# Altium schematic sheet SSSTempLib.SchDoc
size A4
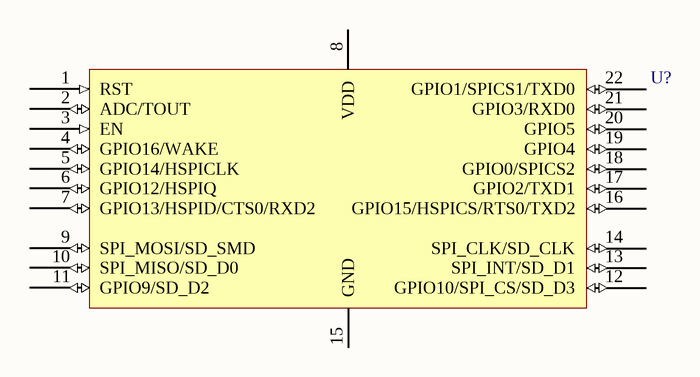
[diagram p0: SSSTempLib.SchDoc]

## Parts
U?  ESP-12E  [317060015]  (value not drawn)

## Nets

Not connected (* = marked no-connect by the designer): U? 1(RST) 2(ADC/TOUT) 3(EN) 4(GPIO16/WAKE) 5(GPIO14/HSPICLK) 6(GPIO12/HSPIQ) 7(GPIO13/HSPID/CTS0/RXD2) 8(VDD) 9(SPI_MOSI/SD_SMD) 10(SPI_MISO/SD_D0) 11(GPIO9/SD_D2) 12(GPIO10/SPI_CS/SD_D3) 13(SPI_INT/SD_D1) 14(SPI_CLK/SD_CLK) 15(GND) 16(GPIO15/HSPICS/RTS0/TXD2) 17(GPIO2/TXD1) 18(GPIO0/SPICS2) 19(GPIO4) 20(GPIO5) 21(GPIO3/RXD0) 22(GPIO1/SPICS1/TXD0)

## Library data of the parts
U? = 317060015: RX TXRX MOD WIFI TRACE ANT SMD; Part Number: 317060015; HelpURL: https://www.snapeda.com/parts/ESP8266-12E/ESP-12E/AI-Thinker/view-part/; Price$: 5.28; Digi-Key Part Number: 317060015-ND; Manufacturer Part Number: 317060015; Mouser Part Number: 317060015-ND; HelpURL2: https://www.digikey.com/en/products/detail/seeed-technology-co-ltd/317060015/5775200